# EAGLE design electretPreampTL072_smd (EAGLE 7.6.0)
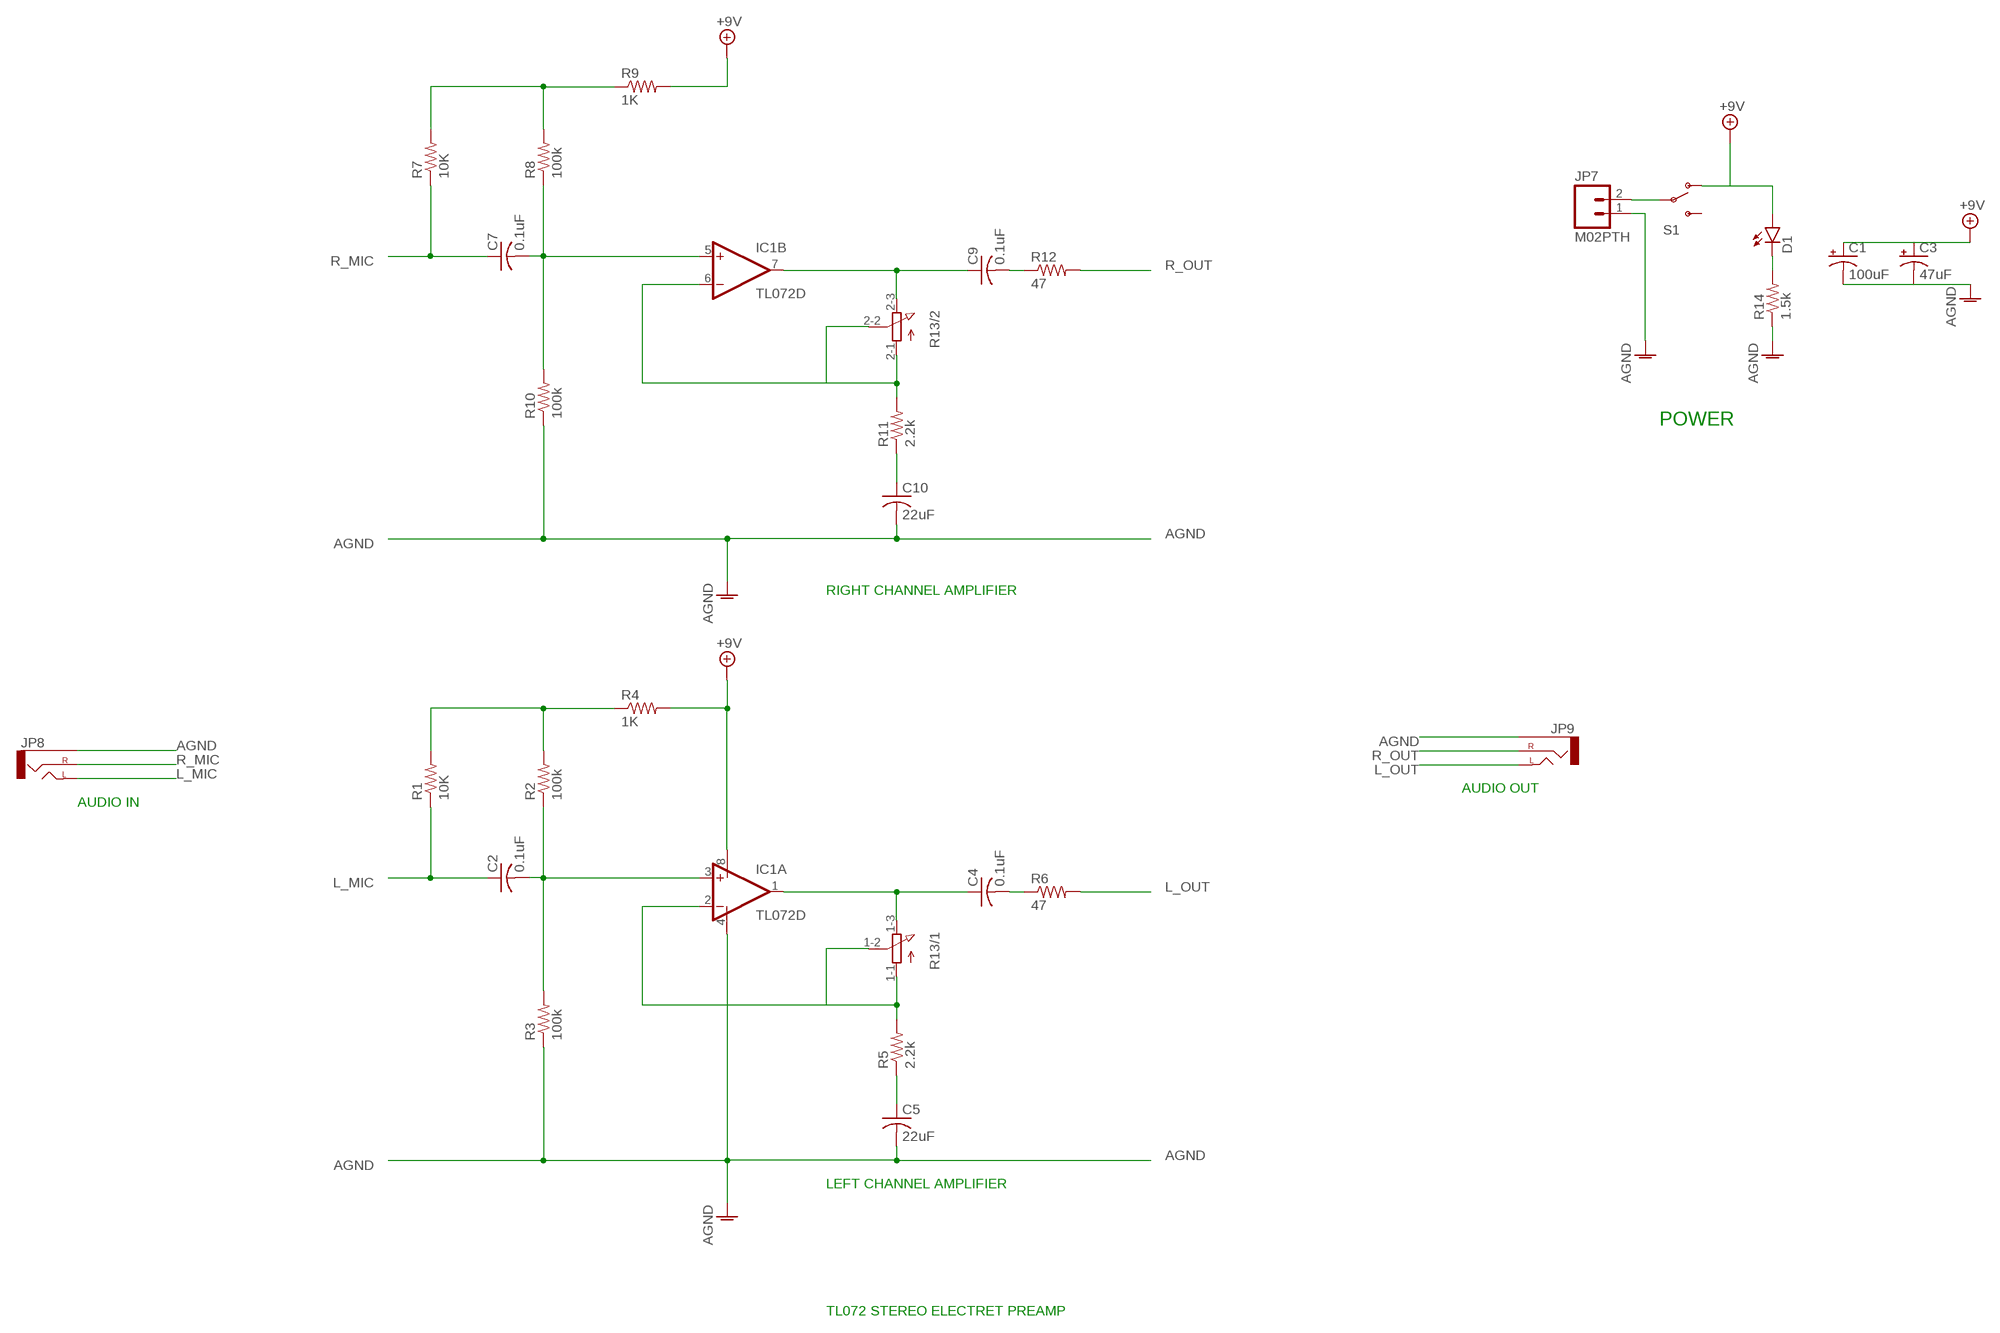
[diagram p0: schematic, sheet 1]

## Parts
C1  100uF  CAP_POLD  [PANASONIC_D]
C2  0.1uF  C-USC0603  [C0603]
C3  47uF  CAP_POLD  [PANASONIC_D]
C4  0.1uF  C-USC0603  [C0603]
C5  22uF  C-USC0603  [C0603]
C7  0.1uF  C-USC0603  [C0603]
C9  0.1uF  C-USC0603  [C0603]
C10  22uF  C-USC0603  [C0603]
D1  LED0603  [LED-0603]
IC1  TL072D  [SO08]
JP7  M02PTH  [1X02]
JP8  AUDIO-JACKSMD2  [AUDIO-JACK-3.5MM-SMD]
JP9  AUDIO-JACKSMD2  [AUDIO-JACK-3.5MM-SMD]
R1  10K  10KOHM-1/10W-1%(0603)0603  [0603-RES]
R2  100k  100KOHM-1/10W-1%(0603)  [0603-RES]
R3  100k  100KOHM-1/10W-1%(0603)  [0603-RES]
R4  1K  1KOHM-1/10W-1%(0603)  [0603-RES]
R5  2.2k  2.2KOHM-1/10W-1%(0603)  [0603-RES]
R6  47  4.7OHM-1/10W-5%(0603)  [0603-RES]
R7  10K  10KOHM-1/10W-1%(0603)0603  [0603-RES]
R8  100k  100KOHM-1/10W-1%(0603)  [0603-RES]
R9  1K  1KOHM-1/10W-1%(0603)  [0603-RES]
R10  100k  100KOHM-1/10W-1%(0603)  [0603-RES]
R11  2.2k  2.2KOHM-1/10W-1%(0603)  [0603-RES]
R12  47  4.7OHM-1/10W-5%(0603)  [0603-RES]
R13  3RP/1610G  [RK097122008T]
R14  1.5k  RESISTOR0603-RES  [0603-RES]
S1  SWITCH-SPDTPTH  [SWITCH-SPDT]

## Nets
+9V: D1.A IC1.8(P:V+) R4.2 R9.2 S1.1(O)
AGND: C1.- C3.- C5.2 C10.2 IC1.4(P:V-) JP7.1 JP8.SLEEVE JP9.SLEEVE R3.1 R10.1 R14.1
BATT+: C1.+ C3.+ JP7.2 S1.2(P) ; supply symbol labelled +9V
L_MIC: C2.1 JP8.TIP(LEFT) R1.1
L_OUT: JP9.TIP(LEFT) R6.2
L_OUT_PRE: C4.1 IC1.1(A:OUT) R13.1-3(/1:E)
N$1: D1.C R14.2
N$2: C4.2 R6.1
N$3: IC1.2(A:-IN) R5.2 R13.1-1(/1:A) R13.1-2(/1:S)
N$4: C5.1 R5.1
N$5: C2.2 IC1.3(A:+IN) R2.1 R3.2
N$7: C9.2 R12.1
N$8: R1.2 R2.2 R4.1
N$9: IC1.6(B:-IN) R11.2 R13.2-1(/2:A) R13.2-2(/2:S)
N$10: C10.1 R11.1
N$11: C7.2 IC1.5(B:+IN) R8.1 R10.2
N$12: R7.2 R8.2 R9.1
R_MIC: C7.1 JP8.RING(RIGHT) R7.1
R_OUT: JP9.RING(RIGHT) R12.2
R_OUT_PRE: C9.1 IC1.7(B:OUT) R13.2-3(/2:E)
Unconnected: S1.3(S)

## Notes on the sheet
- POWER
- RIGHT CHANNEL AMPLIFIER
- AUDIO OUT
- AUDIO IN
- LEFT CHANNEL AMPLIFIER
- TL072 STEREO ELECTRET PREAMP

## Library data of the parts
C1 C3 = SparkFun-Passives:CAP_POL: Capacitor Polarized These are standard SMD and PTH capacitors. Normally 10uF, 47uF, and 100uF in electrolytic and tantalum varieties. Always verify the external diameter of the through hole cap, it varies with capacity, voltage, and manufacturer. The EIA devices should be standard.
C2 C4 C5 C7 C9 C10 = resistor:C-US: CAPACITOR, American symbol
D1 = SparkFun-LED:LED: LEDs Standard schematic elements and footprints for 5mm, 3mm, 1206, and 0603 sized LEDs. 5mm - Spark Fun Electronics SKU : COM-00529 (and others)
IC1 = linear:TL072: OP AMP
JP7 = SparkFun-Connectors:M02: Standard 2-pin 0.1" header. Use with - straight break away headers ( PRT-00116) - right angle break away headers (PRT-00553) - swiss pins (PRT-00743) - machine pins (PRT-00117) - female headers (PRT-00115) Molex polarized connector foot print use with: PRT-08233 with associated crimp pins and housings. 2.54_SCREWTERM for use with PRT-10571. 3.5mm Screw Terminal footprints for PRT-08084 5mm Screw Terminal footprints for use with PRT-08432
JP8 JP9 = SparkFun-Connectors:AUDIO-JACK: 3.5mm Audio Jack Simple 3.5mm common PCB mount audio jack. Variant PTH is our storefront SKU PRT-08032; PROD_ID: CONN-10353
R1 R7 = SparkFun-Resistors:10KOHM-1/10W-1%(0603): RES-00824; PROD_ID: RES-00824
R2 R3 R8 R10 = SparkFun-Resistors:100KOHM-1/10W-1%(0603): RES-07828; PROD_ID: RES-07828
R4 R9 = SparkFun-Resistors:1KOHM-1/10W-1%(0603): RES-07856; PROD_ID: RES-07856
R5 R11 = SparkFun-Resistors:2.2KOHM-1/10W-1%(0603): RES-08272; PROD_ID: RES-08272
R6 R12 = SparkFun-Resistors:4.7OHM-1/10W-5%(0603): RES-08295; PROD_ID: RES-08295
R13 = twomey:3RP/1610G: 9mm Potentiometer ganged Source: http://www.alps.com/prod/info/E/HTML/Potentiometer/RotaryPotentiometers/RK097/RK097122008T.html
R14 = SparkFun-Passives:RESISTOR: Resistor Basic schematic elements and footprints for 0603, 1206, and PTH resistors.
S1 = SparkFun-Electromechanical:SWITCH-SPDT: SPDT Switch Simple slide switch, Spark Fun Electronics SKU : COM-00102 DPDT SMT slide switch, AYZ0202, SWCH-08179; PROD_ID: SWCH-08261

## Board
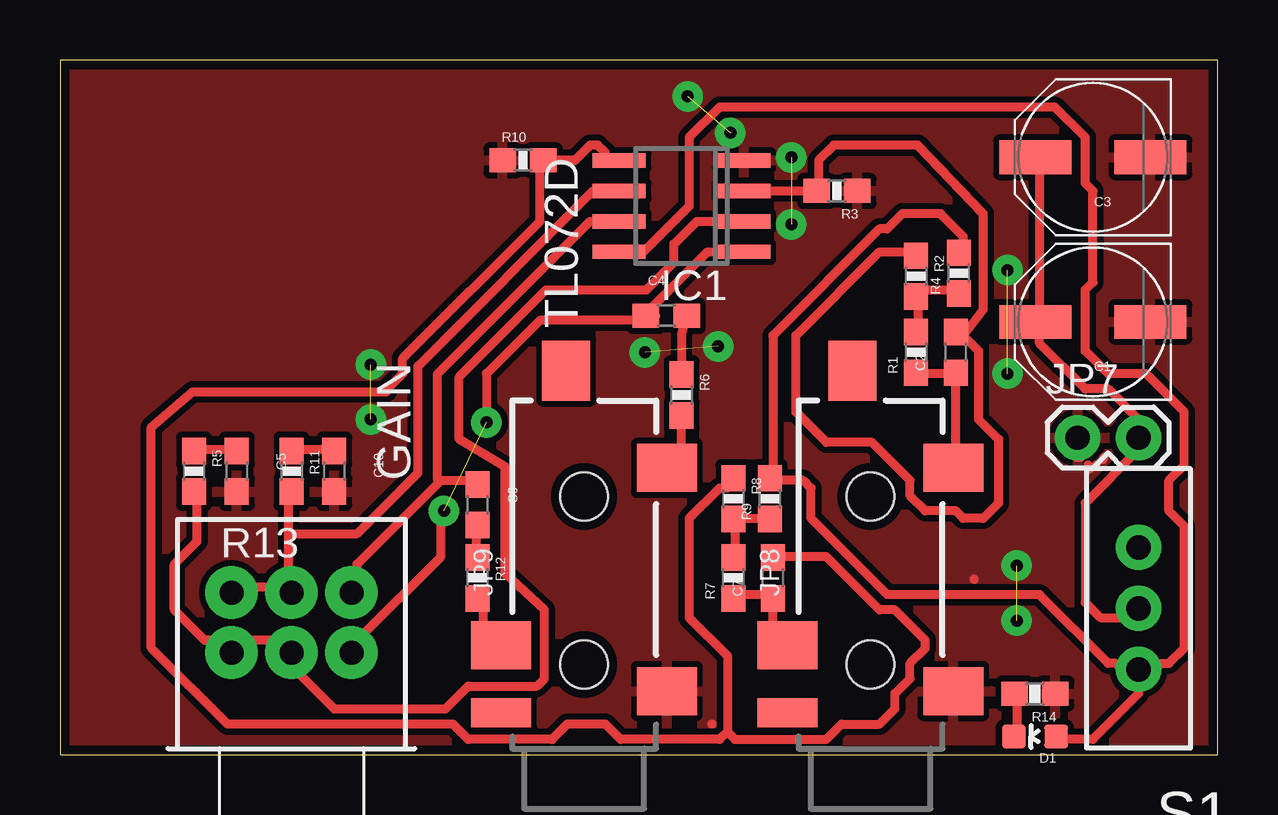
[diagram p1: board, top side]

Size 48.26 x 28.95 mm. Coordinates in mm from the lower left corner, seen from the top.
Outline: 0,28.95 0,0 48.26,0 48.26,28.95 0,28.95
Copper layers (1*16): Top 0.035mm / dielectric 1.5mm / Bottom 0.035mm
Design rules "default *": minimum track width 15mil, minimum drill 24mil, track to track 10mil, track to pad 10mil, pad to pad 10mil, via to via 10mil, smd to smd 10mil, copper to edge 15mil, drill to drill 8mil, minimum pad ring 10mil, minimum via ring 8mil, stop-mask expansion 4mil, vias tented up to drill 0mil, thermal gap 10mil

### Footprints (pad centres in the part's own frame; a part is rotated, then mirrored left to right if it is on the bottom)
PANASONIC_D = smd 3 x 1.4: + 2.4,0; - -2.4,0
C0603 = smd 1.1 x 1: 1 -0.85,0; 2 0.85,0
LED-0603 = smd 1 x 1: A 0,-0.877; C 0,0.877
SO08 = smd 0.6 x 2.2: 1 -1.905,-2.6; 2 -0.635,-2.6; 3 0.635,-2.6; 4 1.905,-2.6; 5 1.905,2.6; 6 0.635,2.6; 7 -0.635,2.6; 8 -1.905,2.6
1X02 = drill 1.016 pad 1.88: 1 0,0; 2 2.54,0
AUDIO-JACK-3.5MM-SMD = smd 2 x 2.5: RING 4.3,3.45; SLEEVE 2.4,-3.45; TIP 11.7,-3.45 | smd 1.2 x 2.5: RSH 1.5,3.45 | smd 2.5 x 2: TSH 15.75,0.75 | hole 2: 3.5,0; 10.5,0
0603-RES = smd 1.1 x 1: 1 -0.85,0; 2 0.85,0
RK097122008T = drill 1 pad 2.184: 1-1 -2.5,4; 1-2 0,4; 1-3 2.5,4; 2-1 -2.5,6.5; 2-2 0,6.5; 2-3 2.5,6.5
SWITCH-SPDT = drill 1.016 pad 1.88: 1 0,2.54; 2 0,0; 3 0,-2.54

### Placement (x,y rotation side)
C1  43.05,18.03 180 top
C2  37.34,16.76 90 top
C3  43.05,24.89 180 top
C4  25.27,18.29 0 top
C5  7.37,11.81 270 top
C7  29.72,7.37 90 top
C9  17.4,10.41 270 top
C10  11.43,11.81 270 top
D1  40.64,0.76 90 top
IC1  25.91,22.86 90 top
JP7  42.42,13.21 0 top
JP8  33.78,0.25 90 top
JP9  21.84,0.25 90 top
R1  35.69,16.76 90 top
R2  35.69,19.94 270 top
R3  32.38,23.5 180 top
R4  37.47,20.07 90 top
R5  5.59,11.81 270 top
R6  25.91,14.99 270 top
R7  28.07,7.37 90 top
R8  28.07,10.67 270 top
R9  29.59,10.67 90 top
R10  19.3,24.77 0 top
R11  9.65,11.81 270 top
R12  17.4,7.37 270 top
R13  9.65,0.25 0 top
R14  40.64,2.54 180 top
S1  44.96,6.1 180 top

### Tracks (layer width: path | path; a pad name or v marks a point on that pad's centre or on a via)
+9V
  Top 0.381: R4.2 37.66,20.95 37.66,21.59 36.7,22.54 35.12,22.54 34.48,21.91 34.16,21.91 29.72,17.46 29.72,11.75 R9.2 29.72,11.43 30.99,11.43 31.3,11.11 31.3,9.84 34.48,6.67 40.83,6.67 43.69,3.81 44.01,3.81 44.96,2.86 | S1.1 44.96,2.86 | 44.96,2.86 44.96,2.54 43.05,0.64 41.78,0.64 D1.A | IC1.8 24.32,20.95 26.23,22.86 26.23,25.72 27.5,26.99 41.47,26.99 42.74,25.72 42.74,23.81 43.05,23.5 43.05,19.68 42.74,19.37 42.74,16.83 43.69,15.88 45.28,15.88 46.86,14.29 46.86,12.06 46.23,11.43 46.23,10.16 46.86,9.53 46.86,4.45 46.23,3.81 45.91,3.81 44.96,2.86
AGND  (via drill 0.5 pad 1.27)  (6 unrouted)
  Top 0.381: 27.18,1.27 27.16,1.28 | 38.1,7.3 38.1,7.32 | 42.37,12.38 42.55,12.38 JP7.1 42.55,13.02 42.37,13.02 | 43.18,12.06 43.15,12.01 | 42.86,12.06 42.92,11.9 | 43.5,12.38 43.48,12.3
  other vias: 12.95,13.97 12.95,16.26 39.88,7.87 39.88,5.59 39.5,15.88 39.5,20.19 27.43,17.02 24.38,16.76 30.48,22.1 30.48,24.89 27.94,25.91 26.16,27.43
  pour Top: -0.25,28.96 48.26,28.96 48.26,0 0,0
BATT+
  Top 0.381: C3.+ 40.83,24.77 40.83,18.1 C1.+ 40.83,17.78 40.83,17.14 42.74,15.24 43.69,15.24 44.96,13.97 JP7.2 44.96,12.7 42.74,10.48 42.74,6.35 43.37,5.71 44.96,5.71 S1.2
L_MIC
  Top 0.381: 37.34,15.88 35.75,15.88 R1.1 | 37.34,15.88 37.34,12.06 JP8.TIP | 37.34,15.88 C2.1
L_OUT
  Top 0.381: R6.2 25.91,12.38 25.59,12.06 JP9.TIP
L_OUT_PRE  (via drill 0.5 pad 1.27)  (1 unrouted)
  Top 0.381: 24.83,18.29 C4.1 | v16,10.16 15.88,10.16 15.88,8.26 12.38,4.76 R13.1-3 | v17.78,13.84 17.78,15.88 20,18.1 24.13,18.1 C4.1 | IC1.1 26.99,20.95 24.45,18.41 C4.1
N$1
  Top 0.381: D1.C 39.88,0.95 39.88,2.54 R14.2
N$2
  Top 0.381: R6.1 25.91,17.46 C4.2
N$3
  Top 0.381: R5.2 5.71,10.79 5.71,8.89 4.76,7.94 4.76,6.03 6.03,4.76 6.99,4.76 R13.1-1 7.3,4.76 9.53,4.76 R13.1-2 9.84,4.45 9.84,3.49 11.43,1.91 16.07,1.91 17.02,2.86 19.88,2.86 20.19,3.17 20.19,6.03 18.54,7.56 18.54,12 16.64,13.14 16.64,15.75 20.26,19.37 24.45,19.37 25.59,20.51 25.59,21.27 26.54,22.23 IC1.2
N$4
  Top 0.381: R5.1 5.71,12.7 7.3,12.7 C5.1
N$5
  Top 0.381: IC1.3 R3.2 31.62,23.5 31.62,24.77 32.26,25.4 35.75,25.4 38.48,22.54 38.48,18.54 37.66,17.46 | 37.66,17.46 37.34,17.78 C2.2 37.66,17.46 | 37.66,17.46 38.29,16.83 38.29,13.97 39.12,13.14 39.12,10.48 38.48,9.84 37.66,9.84 37.34,10.16 36.07,10.16 35.43,10.79 35.43,11.43 33.85,13.02 31.94,13.02 30.67,14.29 30.67,17.46 34.16,20.95 35.43,20.95 R2.1
N$7
  Top 0.381: R12.1 17.34,8.26 17.34,9.53 C9.2
N$8
  Top 0.381: R1.2 35.75,17.78 35.75,19.05 R2.2 35.75,19.37 37.34,19.37 R4.1
N$9
  Top 0.381: 9.53,9.21 9.53,7.3 R13.2-2 9.53,6.99 7.3,6.99 R13.2-1 | 9.53,9.21 9.53,10.79 R11.2 | 9.53,9.21 12.38,9.21 14.92,11.75 14.92,16.19 22.23,23.5 IC1.6
N$10
  Top 0.381: R11.1 9.84,12.7 11.43,12.7 C10.1
N$11
  Top 0.381: IC1.5 22.73,24.77 22.73,25.08 22.42,25.4 22.1,25.4 21.46,24.77 R10.2 20,24.77 20,22.23 14.29,16.51 14.29,15.88 13.65,15.24 13.59,15.11 5.52,15.11 3.81,13.65 3.81,4.45 6.99,1.27 16.38,1.27 17.02,0.64 20.51,0.64 21.14,1.27 22.73,1.27 23.37,0.64 27.5,0.64 27.81,0.95 | 27.81,0.95 28.13,0.64 31.94,0.64 32.58,1.27 34.16,1.27 34.8,1.91 34.8,2.54 35.43,3.17 35.43,3.81 36.07,4.45 36.07,4.76 34.8,6.03 34.16,6.03 31.94,8.26 29.72,8.26 C7.2 | 27.81,0.95 27.81,4.13 26.23,5.71 26.23,9.84 27.5,11.11 27.81,11.11 28.13,11.43 R8.1
N$12
  Top 0.381: R7.2 28.13,8.26 28.13,9.53 R8.2 28.13,9.84 29.4,9.84 R9.1
R_MIC
  Top 0.381: R7.1 28.13,6.67 29.72,6.67 C7.1 29.72,5.08 30.04,4.76 JP8.RING
R_OUT
  Top 0.381: R12.2 17.65,6.35 17.65,5.4 18.29,4.76 JP9.RING
R_OUT_PRE
  Top 0.381: 15.88,11.43 17.34,11.43 C9.1 | 12.38,6.99 R13.2-3 12.38,7.3 12.38,7.94 15.88,11.43 | IC1.7 22.1,22.23 15.75,15.88 15.75,11.43 15.88,11.43

### Text on the board
tNames: TL072D | GAIN
tValues: STEREO ELECTRET / PRE-AMP V 0.2 / RTWOMEY 2016 | POW | VOL | OUT | MIC